# EAGLE design boardShildSchematic (EAGLE 6.6.0)
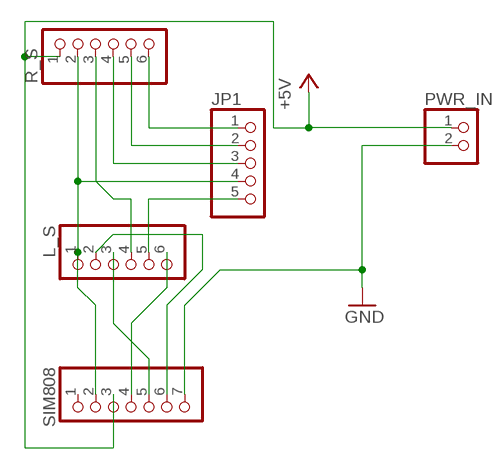
[diagram p0: schematic, sheet 1]

## Parts
JP1  PINHD-1X5  [1X05]
L_S  PINHD-1X6  [1X06]
PWR_IN  PINHD-1X2  [1X02]
R_S  PINHD-1X6  [1X06]
SIM808  PINHD-1X7  [1X07]

## Nets
+5V: PWR_IN.1 R_S.1 SIM808.3
GND: PWR_IN.2 SIM808.7
N$1: JP1.1 R_S.6
N$2: JP1.2 R_S.5
N$3: JP1.3 R_S.4
N$4: L_S.4 R_S.3
N$5: L_S.2 SIM808.6
N$6: JP1.5 L_S.5
N$7: JP1.4 L_S.1 R_S.2 SIM808.2
N$8: L_S.3 SIM808.5
N$9: L_S.6 SIM808.4
Unconnected: SIM808.1

## Library data of the parts
JP1 = pinhead:PINHD-1X5: PIN HEADER
L_S R_S = pinhead:PINHD-1X6: PIN HEADER
PWR_IN = pinhead:PINHD-1X2: PIN HEADER
SIM808 = pinhead:PINHD-1X7: PIN HEADER

## Board
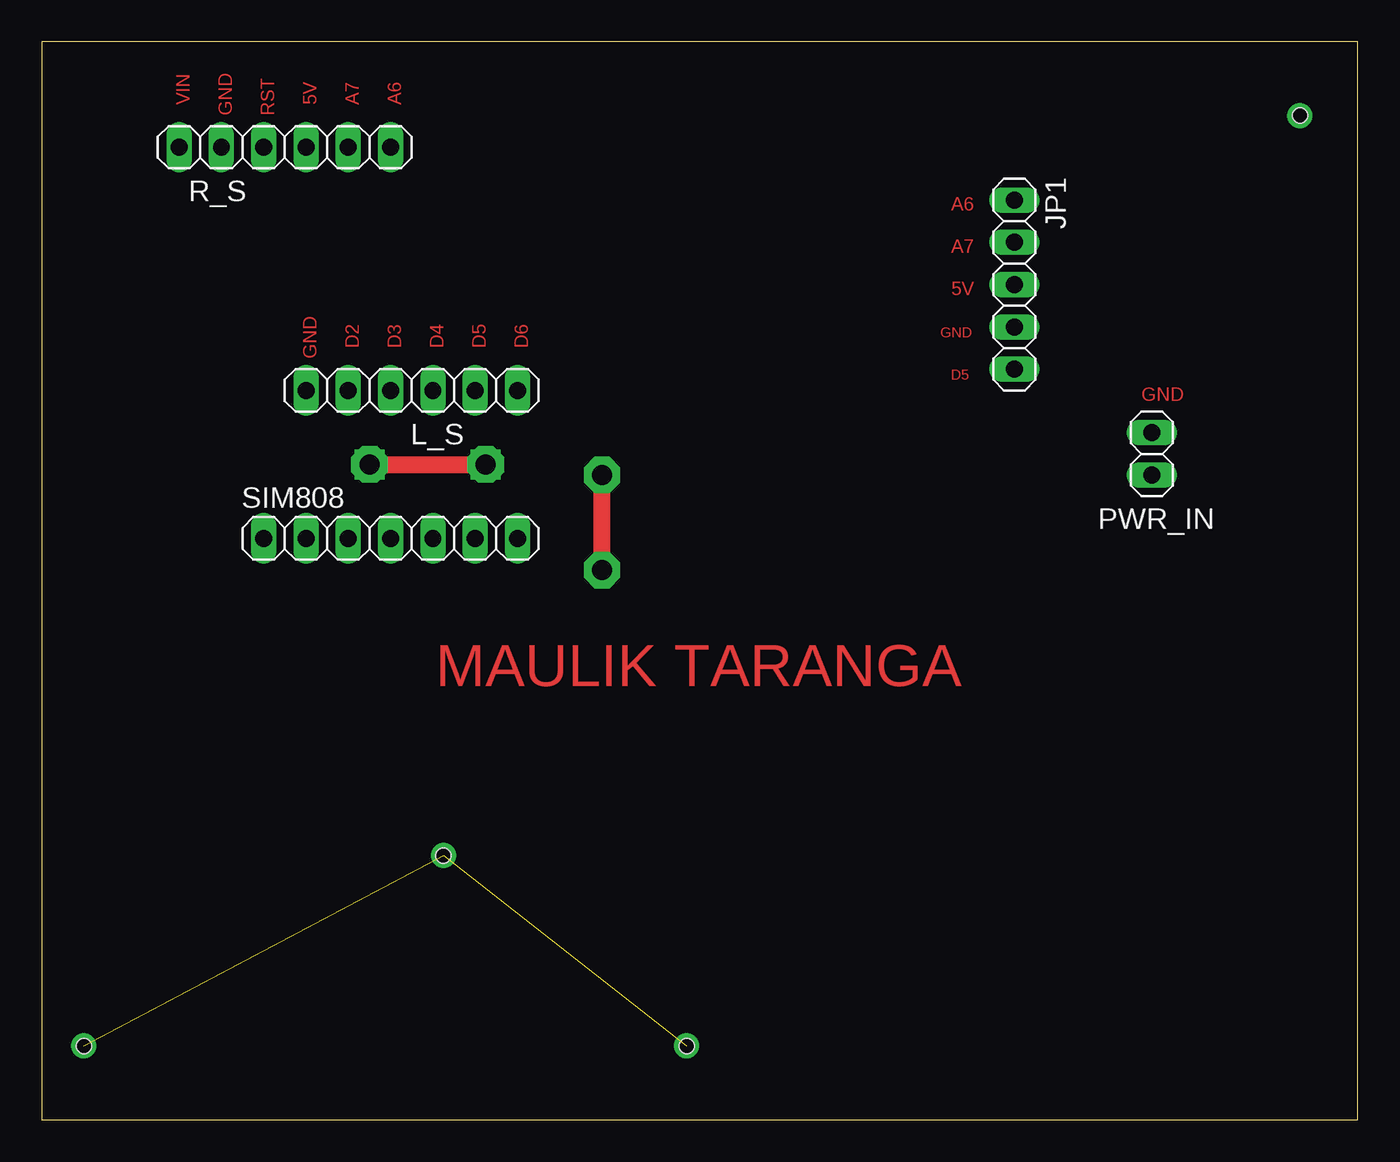
[diagram p1: board, top side]
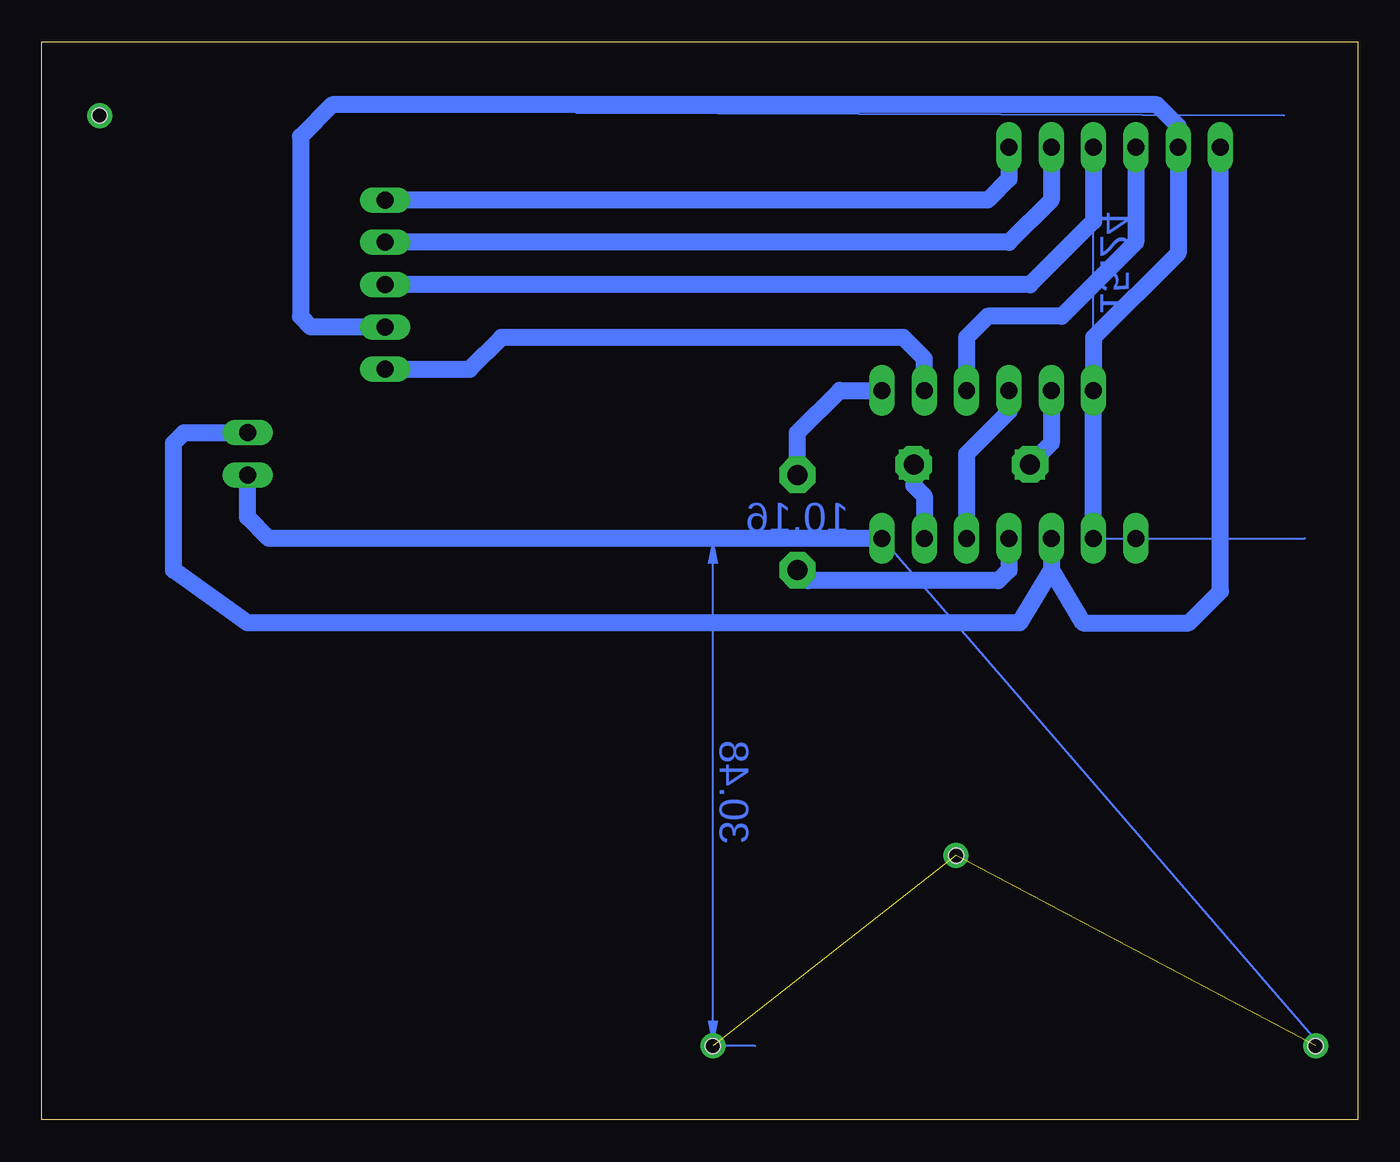
[diagram p2: board, bottom side, seen from below]

Size 79.05 x 64.76 mm. Coordinates in mm from the lower left corner, seen from the top.
Outline: 0,0 79.05,0 79.05,64.76 0,64.76 0,0
Copper layers (1*16): Top 0.035mm / dielectric 1.5mm / Bottom 0.035mm
Design rules "default *": minimum track width 10mil, minimum drill 24mil, track to track 30mil, track to pad 15mil, pad to pad 8mil, via to via 8mil, smd to smd 8mil, copper to edge 40mil, drill to drill 8mil, minimum pad ring 10mil, minimum via ring 8mil, stop-mask expansion 4mil, vias tented up to drill 0mil, thermal gap 10mil
Holes 0.9 mm at 75.56,60.32 24.13,15.88 38.73,4.45 2.54,4.45

### Footprints (pad centres in the part's own frame; a part is rotated, then mirrored left to right if it is on the bottom)
1X05 = drill 1.016 long: 1 -5.08,0; 2 -2.54,0; 3 0,0; 4 2.54,0; 5 5.08,0
1X06 = drill 1.016 long: 1 -6.35,0; 2 -3.81,0; 3 -1.27,0; 4 1.27,0; 5 3.81,0; 6 6.35,0
1X02 = drill 1.016 long: 1 -1.27,0; 2 1.27,0
1X07 = drill 1.016 long: 1 -7.62,0; 2 -5.08,0; 3 -2.54,0; 4 0,0; 5 2.54,0; 6 5.08,0; 7 7.62,0

### Placement (x,y rotation side)
JP1  58.42,50.16 270 top
L_S  22.22,43.81 0 top
PWR_IN  66.67,40.01 270 top
R_S  14.61,58.42 0 top
SIM808  20.96,34.93 0 top

### Tracks (layer width: path | path; a pad name or v marks a point on that pad's centre or on a via)
+5V
  Bottom 1.016: 18.42,33.02 SIM808.3 18.42,34.29 | 18.42,33.02 16.51,29.84 10.16,29.84 8.25,31.75 R_S.1 | 18.42,33.02 20.32,29.84 66.67,29.84 71.12,33.02 71.12,40.64 70.48,41.27 PWR_IN.1
GND
  Bottom 1.016: SIM808.7 65.41,34.93 66.67,36.2 PWR_IN.2
N$1
  Bottom 1.016: R_S.6 20.96,56.52 22.22,55.24 JP1.1
N$2
  Bottom 1.016: R_S.5 18.42,55.24 20.96,52.71 JP1.2
N$3
  Bottom 1.016: R_S.4 15.88,53.98 19.68,50.16 JP1.3
N$4
  Bottom 1.016: R_S.3 13.34,52.71 17.78,48.26 22.22,48.26 23.5,46.99 L_S.4
N$5  (via drill 1.2 pad 0.61, 1.2 pad 2.18)
  Top 1.016: v19.68,39.37 v26.67,39.37
  Bottom 1.016: L_S.2 18.42,40.64 v19.68,39.37 | v26.67,39.37 26.67,38.1 26.04,37.47 SIM808.6
N$6
  Bottom 1.016: L_S.5 26.04,45.72 27.31,46.99 51.44,46.99 53.34,45.09 JP1.5
N$7
  Bottom 1.016: SIM808.2 L_S.1 15.88,46.99 10.8,52.07 R_S.2 10.8,59.69 12.07,60.96 61.59,60.96 63.5,59.05 63.5,48.26 62.87,47.63 JP1.4
N$8
  Bottom 1.016: L_S.3 20.96,42.55 23.5,40.01 SIM808.5
N$9  (via drill 1.2 pad 2.18)
  Top 1.016: v33.66,33.02 v33.66,38.73
  Bottom 1.016: SIM808.4 20.96,33.02 21.59,32.38 33.02,32.38 v33.66,33.02 | v33.66,38.73 33.66,41.27 31.11,43.81 L_S.6
N$16  (via drill 1)  (2 unrouted)
  other vias: 24.13,15.88 38.73,4.45 2.54,4.45
N$17  (via drill 1)
  other vias: 75.56,60.32
(copper drawn outside any net)
  shapes: Bottom area x6

### Text on the board
Top: VIN | GND | RST | 5V | A7 | A6 | A6 | A7 | 5V | D2 | D3 | D4 | D5 | D6 | GND | GND | D5 | GND | MAULIK TARANGA